# Altium schematic sheet schematic.SchDoc
size A2; SheetNumber: 1; SheetTotal: 1
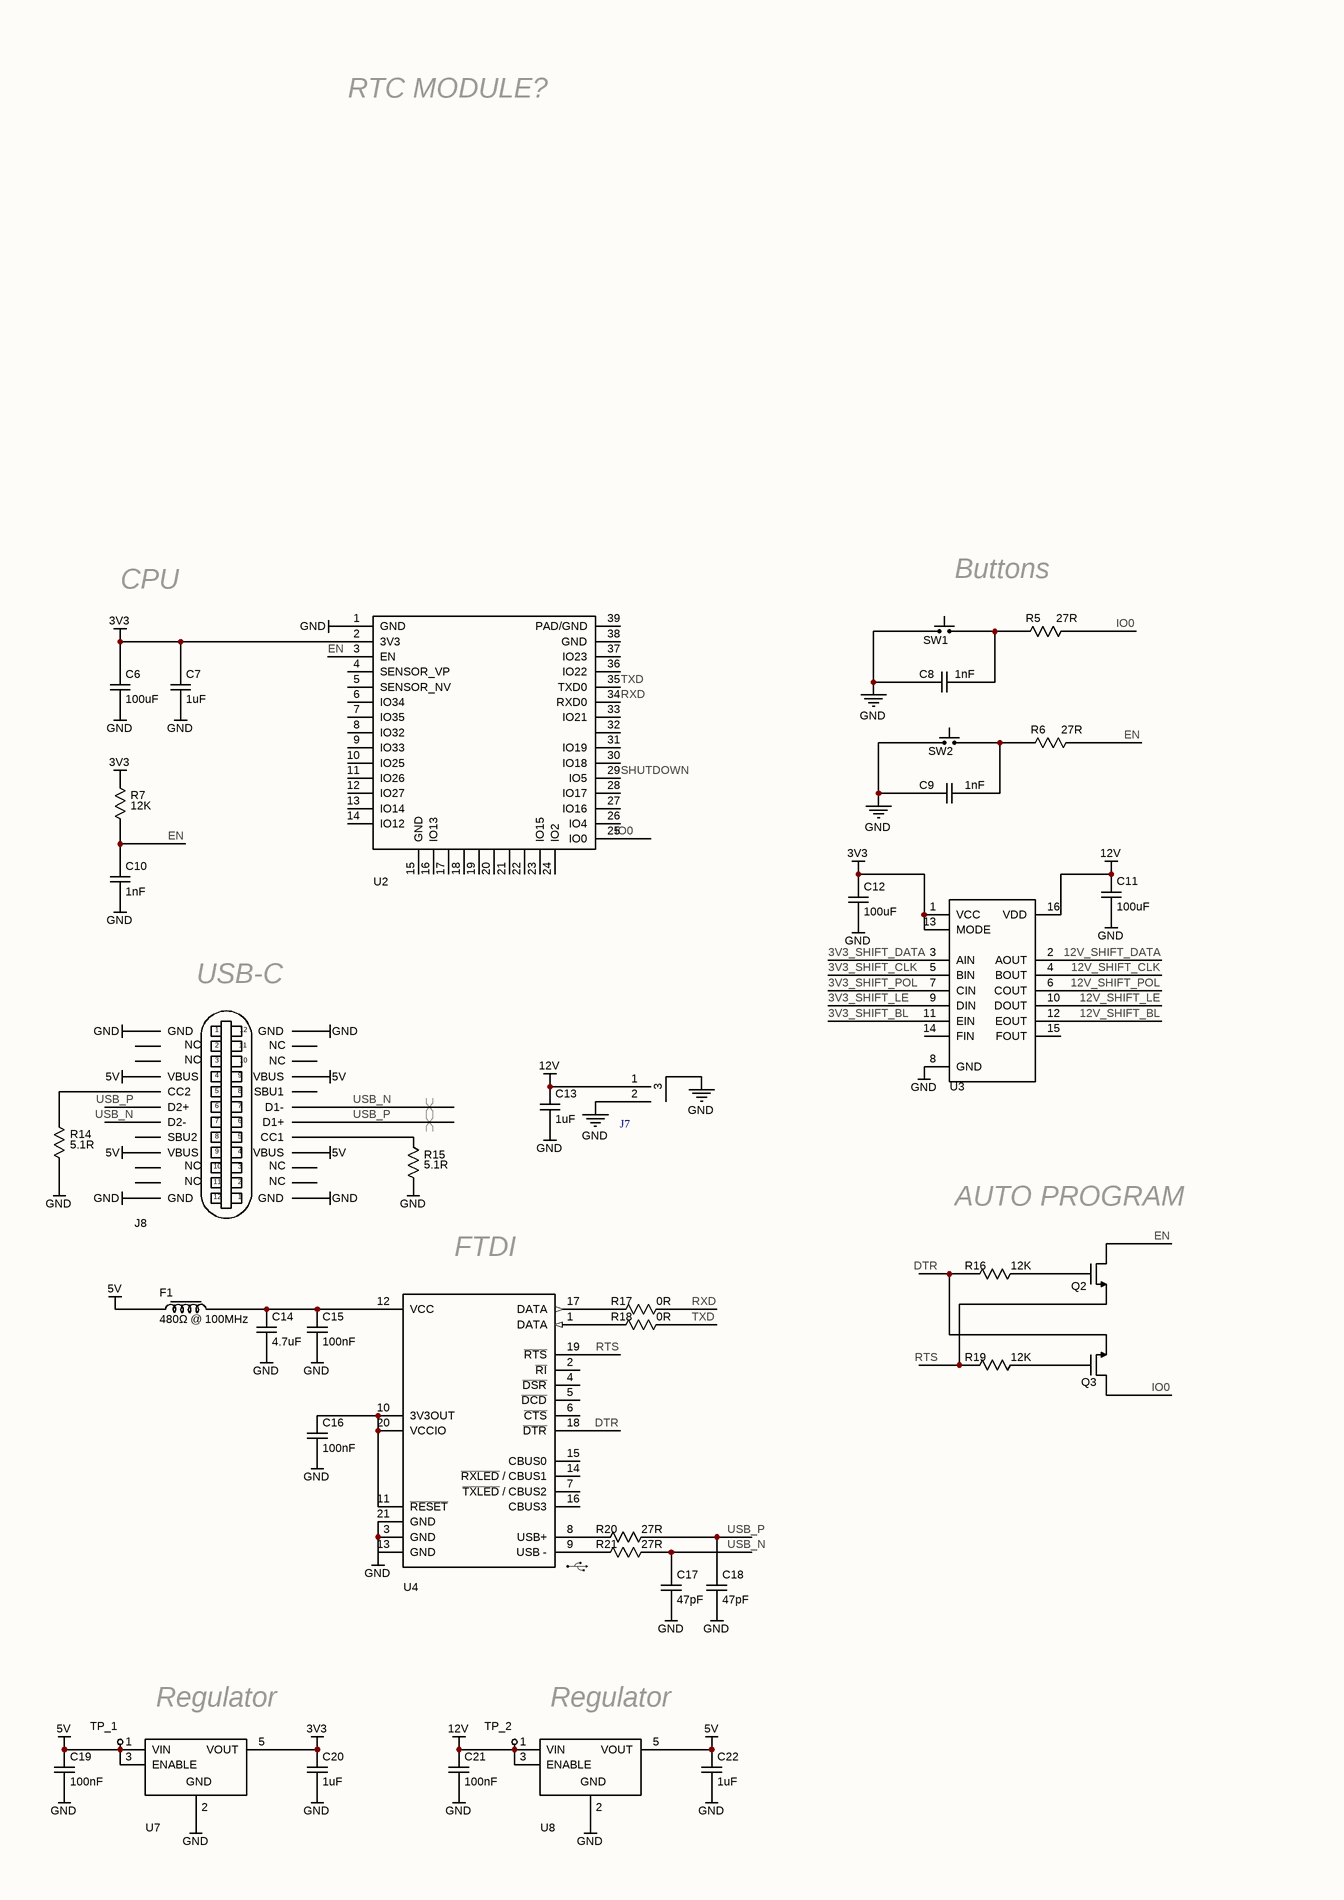
[diagram p0: schematic.SchDoc, left]
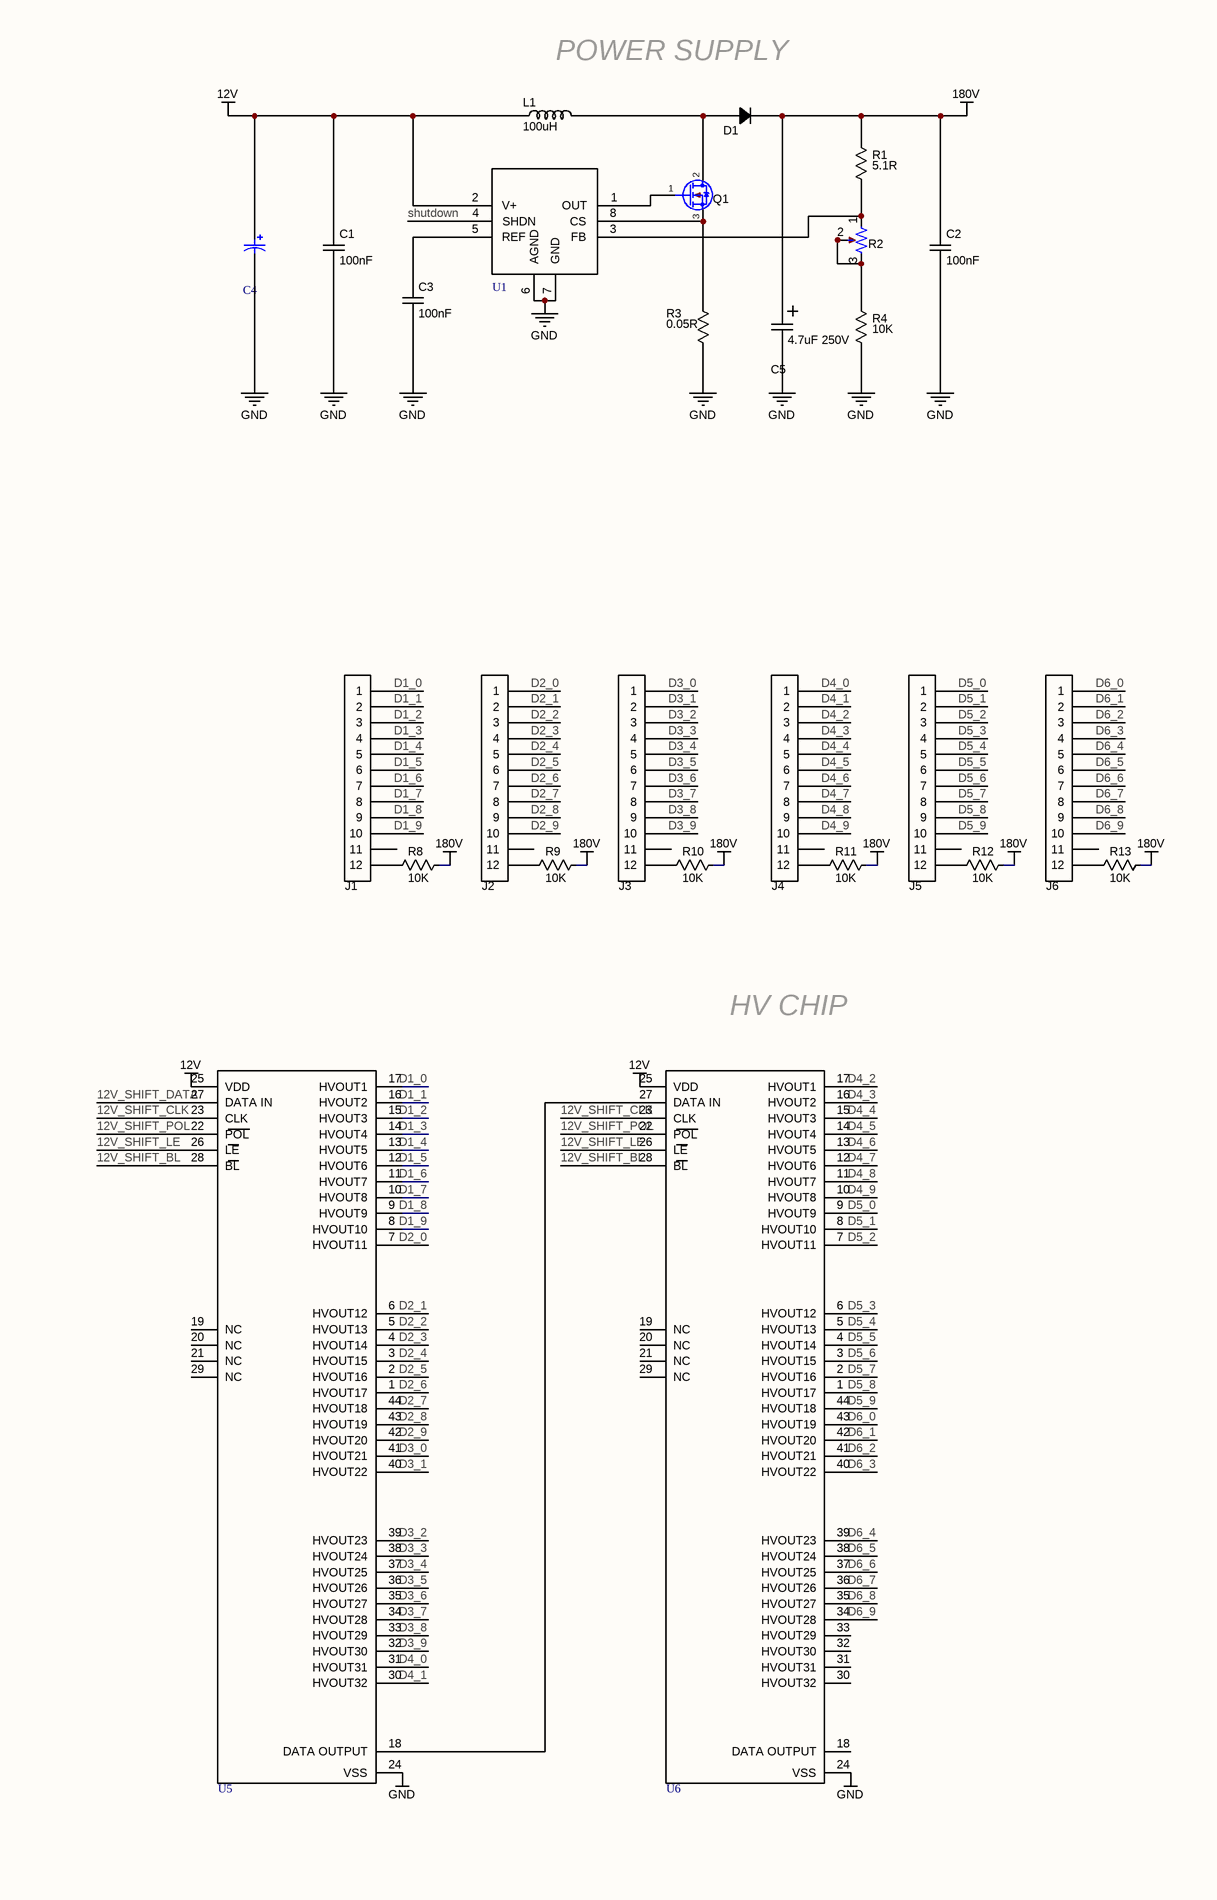
[diagram p1: schematic.SchDoc, right]

## Parts
C1  value 100nF  [capacitor 0603]  (hidden comment: passive_5)
C2  value 100nF  [capacitor 0603]  (hidden comment: passive_5)
C3  value 100nF  [capacitor 0603]  (hidden comment: passive_5)
C4  Tantal-kondensatorer  [TAJD107K020RNJ]  (value not drawn)
C5  value 4.7uF 250V  [4.7uF 250V]  (hidden comment: cappacitor)
C6  value 100uF  [capacitor 0603]  (hidden comment: passive_5)
C7  value 1uF  [capacitor 0603]  (hidden comment: passive_5)
C8  value 1nF  [capacitor 0603]  (hidden comment: passive_5)
C9  value 1nF  [capacitor 0603]  (hidden comment: passive_5)
C10  value 1nF  [capacitor 0603]  (hidden comment: passive_5)
C11  value 100uF  [capacitor 0603]  (hidden comment: passive_5)
C12  value 100uF  [capacitor 0603]  (hidden comment: passive_5)
C13  value 1uF  [capacitor 0603]  (hidden comment: passive_5)
C14  value 4.7uF  [capacitor 0603]  (hidden comment: passive_5)
C15  value 100nF  [capacitor 0603]  (hidden comment: passive_5)
C16  value 100nF  [capacitor 0603]  (hidden comment: passive_5)
C17  value 47pF  [capacitor 0603]  (hidden comment: passive_5)
C18  value 47pF  [capacitor 0603]  (hidden comment: passive_5)
C19  value 100nF  [capacitor 0603]  (hidden comment: passive_5)
C20  value 1uF  [capacitor 0603]  (hidden comment: passive_5)
C21  value 100nF  [capacitor 0603]  (hidden comment: passive_5)
C22  value 1uF  [capacitor 0603]  (hidden comment: passive_5)
D1  ES2F-E3/52T  [ES2F-E3/52T]  (value not drawn)
F1  value 480Ω @ 100MHz  [ferrit bead 0603]  (hidden comment: passive_8)
J1  Header 2mm  [9159 edge connector]  (value not drawn)
J2  Header 2mm  [9159 edge connector]  (value not drawn)
J3  Header 2mm  [9159 edge connector]  (value not drawn)
J4  Header 2mm  [9159 edge connector]  (value not drawn)
J5  Header 2mm  [9159 edge connector]  (value not drawn)
J6  Header 2mm  [9159 edge connector]  (value not drawn)
J7  dc-jack  [BarrelJack]  (value not drawn)
J8  USB 2.0  [USB4105-GF-A]  (value not drawn)
L1  value 100uH  [SRR1210-101M]  (hidden comment: SRR1210-101M)
Q1  regulator_5  [IRF740STRLPBF]  (value not drawn)
Q2  transistor_7  [S8050]  (value not drawn)
Q3  transistor_7  [S8050]  (value not drawn)
R1  value 5.1R  [resistor 0603]  (hidden comment: passive_2)
R2  potmeter 3314G-1-502E  [potmeter 3314G-1-502E]  (value not drawn)
R3  value 0.05R  [resistor 0805]  (hidden comment: passive_3)
R4  value 10K  [resistor 0603]  (hidden comment: passive_2)
R5  value 27R  [resistor 0603]  (hidden comment: passive_2)
R6  value 27R  [resistor 0603]  (hidden comment: passive_2)
R7  value 12K  [resistor 0603]  (hidden comment: passive_2)
R8  value 10K  [resistor 0603]  (hidden comment: passive_2)
R9  value 10K  [resistor 0603]  (hidden comment: passive_2)
R10  value 10K  [resistor 0603]  (hidden comment: passive_2)
R11  value 10K  [resistor 0603]  (hidden comment: passive_2)
R12  value 10K  [resistor 0603]  (hidden comment: passive_2)
R13  value 10K  [resistor 0603]  (hidden comment: passive_2)
R14  value 5.1R  [resistor 0603]  (hidden comment: passive_2)
R15  value 5.1R  [resistor 0603]  (hidden comment: passive_2)
R16  value 12K  [resistor 0603]  (hidden comment: passive_2)
R17  value 0R  [resistor 0603]  (hidden comment: passive_2)
R18  value 0R  [resistor 0603]  (hidden comment: passive_2)
R19  value 12K  [resistor 0603]  (hidden comment: passive_2)
R20  value 27R  [resistor 0603]  (hidden comment: passive_2)
R21  value 27R  [resistor 0603]  (hidden comment: passive_2)
SW1  sensor_3  [KMR621NG LFS]  (value not drawn)
SW2  sensor_3  [KMR621NG LFS]  (value not drawn)
TP_1  misc_3  [testpoint round, diameter 1.5mm]  (value not drawn)
TP_2  misc_3  [testpoint round, diameter 1.5mm]  (value not drawn)
U1  MAX1771  [SOIC-8]  (value not drawn)
U2  cpu_7  [ESP32-WROOM-32]  (value not drawn)
U3  MC14504BDTR2G  [MC14504BDTR2G]  (value not drawn)
U4  FTDI  [FT231XQ-R]  (value not drawn)
U5  HV5630PJ  [HV5630PJ]  (value not drawn)
U6  HV5630PJ  [HV5630PJ]  (value not drawn)
U7  regulator_1  [TCR2EF33,LM(CT]  (value not drawn)
U8  regulator_1  [TCR2EF33,LM(CT]  (value not drawn)

## Nets
3V3: C6.2 C7.2 C12.2 C20.2 R7.2 U2.2(3V3) U3.1(VCC) U3.13(MODE) U7.5(VOUT)
5V: C19.2 C22.2 F1.1 J8.A4_B9(VBUS) J8.B4_A9(VBUS) TP_1.1 U7.1(VIN) U7.3(ENABLE) U8.5(VOUT)
12V: C1.2 C4.1 C11.2 C13.2 C21.2 J7.1(Pin_1) L1.1 TP_2.1 U1.2(V+) U3.16(VDD) U5.25(VDD) U6.25(VDD) U8.1(VIN) U8.3(ENABLE)
180V: C2.2 C5.1 D1.2 R1.2 R8.1 R9.1 R10.1 R11.1 R12.1 R13.1
GND: C1.1 C2.1 C3.1 C4.2 C5.2 C6.1 C7.1 C8.2 C9.2 C10.1 C11.1 C12.1 C13.1 C14.1 C15.1 C16.1 C17.1 C18.1 C19.1 C20.1 C21.1 C22.1 J7.2(Pin_2) J7.3(Pin_2) J8.A1_B12(GND) J8.B1_A12(GND) R3.1 R4.1 R14.1 R15.1 SW1.1 SW2.1 U1.6(AGND) U1.7(GND) U2.1(GND) U3.8(GND) U4.3(GND) U4.13(GND) U4.21(GND) U5.24(VSS) U6.24(VSS) U7.2 U8.2
3V3_SHIFT_BL: U3.11(EIN)
3V3_SHIFT_CLK: U3.5(BIN)
3V3_SHIFT_DATA: U3.3(AIN)
3V3_SHIFT_LE: U3.9(DIN)
3V3_SHIFT_POL: U3.7(CIN)
12V_SHIFT_BL: U3.12(EOUT) U5.28(BL) U6.28(BL)
12V_SHIFT_CLK: U3.4(BOUT) U5.23(CLK) U6.23(CLK)
12V_SHIFT_DATA: U3.2(AOUT) U5.27(DATA_IN)
12V_SHIFT_LE: U3.10(DOUT) U5.26(LE) U6.26(LE)
12V_SHIFT_POL: U3.6(COUT) U5.22(POL) U6.22(POL)
D1_0: J1.1 U5.17(HVOUT1)
D1_1: J1.2 U5.16(HVOUT2)
D1_2: J1.3 U5.15(HVOUT3)
D1_3: J1.4 U5.14(HVOUT4)
D1_4: J1.5 U5.13(HVOUT5)
D1_5: J1.6 U5.12(HVOUT6)
D1_6: J1.7 U5.11(HVOUT7)
D1_7: J1.8 U5.10(HVOUT8)
D1_8: J1.9 U5.9(HVOUT9)
D1_9: J1.10 U5.8(HVOUT10)
D2_0: J2.1 U5.7(HVOUT11)
D2_1: J2.2 U5.6(HVOUT12)
D2_2: J2.3 U5.5(HVOUT13)
D2_3: J2.4 U5.4(HVOUT14)
D2_4: J2.5 U5.3(HVOUT15)
D2_5: J2.6 U5.2(HVOUT16)
D2_6: J2.7 U5.1(HVOUT17)
D2_7: J2.8 U5.44(HVOUT18)
D2_8: J2.9 U5.43(HVOUT19)
D2_9: J2.10 U5.42(HVOUT20)
D3_0: J3.1 U5.41(HVOUT21)
D3_1: J3.2 U5.40(HVOUT22)
D3_2: J3.3 U5.39(HVOUT23)
D3_3: J3.4 U5.38(HVOUT24)
D3_4: J3.5 U5.37(HVOUT25)
D3_5: J3.6 U5.36(HVOUT26)
D3_6: J3.7 U5.35(HVOUT27)
D3_7: J3.8 U5.34(HVOUT28)
D3_8: J3.9 U5.33(HVOUT29)
D3_9: J3.10 U5.32(HVOUT30)
D4_0: J4.1 U5.31(HVOUT31)
D4_1: J4.2 U5.30(HVOUT32)
D4_2: J4.3 U6.17(HVOUT1)
D4_3: J4.4 U6.16(HVOUT2)
D4_4: J4.5 U6.15(HVOUT3)
D4_5: J4.6 U6.14(HVOUT4)
D4_6: J4.7 U6.13(HVOUT5)
D4_7: J4.8 U6.12(HVOUT6)
D4_8: J4.9 U6.11(HVOUT7)
D4_9: J4.10 U6.10(HVOUT8)
D5_0: J5.1 U6.9(HVOUT9)
D5_1: J5.2 U6.8(HVOUT10)
D5_2: J5.3 U6.7(HVOUT11)
D5_3: J5.4 U6.6(HVOUT12)
D5_4: J5.5 U6.5(HVOUT13)
D5_5: J5.6 U6.4(HVOUT14)
D5_6: J5.7 U6.3(HVOUT15)
D5_7: J5.8 U6.2(HVOUT16)
D5_8: J5.9 U6.1(HVOUT17)
D5_9: J5.10 U6.44(HVOUT18)
D6_0: J6.1 U6.43(HVOUT19)
D6_1: J6.2 U6.42(HVOUT20)
D6_2: J6.3 U6.41(HVOUT21)
D6_3: J6.4 U6.40(HVOUT22)
D6_4: J6.5 U6.39(HVOUT23)
D6_5: J6.6 U6.38(HVOUT24)
D6_6: J6.7 U6.37(HVOUT25)
D6_7: J6.8 U6.36(HVOUT26)
D6_8: J6.9 U6.35(HVOUT27)
D6_9: J6.10 U6.34(HVOUT28)
DTR: Q3.2 R16.2 U4.18(~{DTR})
EN: C10.2 Q2.3 R6.1 R7.1 U2.3(EN)
IO0: Q3.3 R5.1 U2.25(IO0)
RTS: Q2.2 R19.2 U4.19(~{RTS})
RXD: R17.1 U2.34(RXD0)
shutdown: U1.4(SHDN) U2.29(IO5)
TXD: R18.1 U2.35(TXD0)
USB_N: C17.2 J8.A7(D1-) J8.B7(D2-) R21.1
USB_P: C18.2 J8.A6(D1+) J8.B6(D2+) R20.1
NetC3_2: C3.2 U1.5(REF)
NetC8_1: C8.1 R5.2 SW1.2
NetC9_1: C9.1 R6.2 SW2.2
NetC14_2: C14.2 C15.2 F1.2 U4.12(VCC)
NetC16_2: C16.2 U4.10(3V3OUT) U4.11(~{RESET}) U4.20(VCCIO)
NetD1_1: D1.1 L1.2 Q1.2(D)
NetJ1_12: J1.12 R8.2
NetJ2_12: J2.12 R9.2
NetJ3_12: J3.12 R10.2
NetJ4_12: J4.12 R11.2
NetJ5_12: J5.12 R12.2
NetJ6_12: J6.12 R13.2
NetJ8_A5: J8.A5(CC1) R15.2
NetJ8_B5: J8.B5(CC2) R14.2
NetQ1_1: Q1.1(G) U1.1(OUT)
NetQ1_3: Q1.3(S) R3.2 U1.8(CS)
NetQ2_1: Q2.1 R16.1
NetQ3_1: Q3.1 R19.1
NetR1_1: R1.1 R2.1 U1.3(FB)
NetR2_2: R2.2 R2.3 R4.2
NetR17_2: R17.2 U4.17(DATA)
NetR18_2: R18.2 U4.1(DATA)
NetR20_2: R20.2 U4.8(USB+)
NetR21_2: R21.2 U4.9(USB_-)
NetU5_18: U5.18(DATA_OUTPUT) U6.27(DATA_IN)

Not connected (* = marked no-connect by the designer): J1 11; J2 11; J3 11; J4 11; J5 11; J6 11; J8 A8(SBU1) B8(SBU2); U2 4(SENSOR_VP) 5(SENSOR_NV) 6(IO34) 7(IO35) 8(IO32) 9(IO33) 10(IO25) 11(IO26) 12(IO27) 13(IO14) 14(IO12) 15(GND) 16(IO13) 17 18 19 20 21 22 23(IO15) 24(IO2) 26(IO4) 27(IO16) 28(IO17) 30(IO18) 31(IO19) 32 33(IO21) 36(IO22) 37(IO23) 38(GND) 39(PAD/GND); U3 14(FIN) 15(FOUT); U4 2(~{RI}) 4(~{DSR}) 5(~{DCD}) 6(~{CTS}) 7(~{TXLED}_/_CBUS2) 14(~{RXLED}_/_CBUS1) 15(CBUS0) 16(CBUS3); U5 19(NC) 20(NC) 21(NC) 29(NC); U6 18(DATA_OUTPUT) 19(NC) 20(NC) 21(NC) 29(NC) 30(HVOUT32) 31(HVOUT31) 32(HVOUT30) 33(HVOUT29)

## Layout directives
differential pair: USB_N, USB_P

## Notes on the sheet
- POWER SUPPLY
- RTC MODULE?
- Buttons
- CPU
- (near J8) USB-C
- HV CHIP
- AUTO PROGRAM
- FTDI
- Regulator
- (in symbol connector_35) 1; 12; NC; 2; 11; 3; 10; 4; 9; 5; 8; 6; 7
- (in symbol regulator_1) GND

## Library data of the parts
C1-C3 C6-C22 = passive_5: Capacitor 0603
C4 = Tantal-kondensatorer: Value: 100uF
C5 = cappacitor: 4.7uF 250Vc; ComponentLink1Description: New link; ComponentLink1URL: https://www.digikey.ca/en/products/detail/kemet/A759KS475M2EAAE496/6196534
D1 = ES2F-E3/52T: diode; ComponentLink1Description: New link; ComponentLink1URL: https://www.digikey.no/en/products/detail/vishay-general-semiconductor-diodes-division/ES2F-E3-52T/1091445?s=N4IgTCBcDaIAQB0AuBRAymAYgWhQZgHoBWMAFRAF0BfIA
F1 = passive_8: Ferrite bead 0603
J1-J6 = edge connector: Header male 1x6, pitch 2mm; ComponentLink1Description: link; ComponentLink1URL: https://www.digikey.no/en/products/detail/kyocera-avx/009159012651906/15995075
J8 = connector_35: USB-C (2.0); Manufacturer 1: GCT; Supplier 1: Digi-Key; Supplier Part Number 1: 2073-USB4105-GF-ACT-ND; Manufacturer Part Number 1: USB4105-GF-A; Link: https://www.digikey.no/product-detail/no/gct/USB4105-GF-A/2073-USB4105-GF-ACT-ND/11198510
Q1 = regulator_5: IRF740STRLPBF; ComponentLink1Description: New link; ComponentLink1URL: https://www.digikey.ca/en/products/detail/vishay-siliconix/IRF740STRLPBF/856617?s=N4IgTCBcDaIAQB0AuBJASgMQOwBYAMAygCpoAyACgEIYgC6AvkA
Q2 Q3 = transistor_7: S8050 NPN TRANSISTOR
R1 R4-R21 = passive_2: Resistor 0603
R3 = passive_3: Resistor 0805; Link: https://www.digikey.no/en/products/detail/thin-film-technology-corp/D1WEL0805CR050F-T5/16735407
SW1 SW2 = sensor_3: Tactile switch SMD, tiny; Manufacturer 1: C&K; Supplier 1: Digi-Key; Supplier Part Number 1: CKN10684CT-ND; Manufacturer Part Number 1: KMR621NG LFS; Link: https://www.digikey.no/product-detail/en/c-k/KMR621NG-LFS/CKN10684CT-ND/6035356
TP_1 TP_2 = misc_3: Test-point round, diameter 1.5mm
U2 = cpu_7: ESP32-WROOM-32; ComponentLink1Description: New link; ComponentLink1URL: https://www.digikey.no/no/products/detail/espressif-systems/ESP32-WROOM-32E-H4/12696413
U3 = MC14504BDTR2G: Level shifter, 3.3V to 12V; Link: https://www.digikey.no/en/products/detail/onsemi/MC14504BDTR2G/1478864
U4 = ic_1: USB to UART converter, FTDI, single, 20 pins, QFN; Manufacturer 1: FTDI, Future Technology Devices International Ltd; Supplier 1: Digi-Key; Supplier Part Number 1: 768-1128-1-ND; Manufacturer Part Number 1: FT231XQ-R
U7 U8 = regulator_1: LDO fixed, 3.3V output, 0.2V dropout, 200mA; Manufacturer 1: Toshiba Semiconductor and Storage; Supplier 1: Digi-Key; Supplier Part Number 1: TCR2EF33LM(CTCT-ND; Manufacturer Part Number 1: TCR2EF33,LM(CT; Output voltage: 3.3V; Dropout: 0.2V; Current: 200mA; Link: https://www.digikey.no/product-detail/en/toshiba-semiconductor-and-storage/TCR2EF33-LM-CT/TCR2EF33LM-CTCT-ND/4503328
J7 = dc-jack: ComponentLink1Description: New link; ComponentLink1URL: https://www.digikey.no/en/products/detail/cui-devices/PJ-002A/96962
L1 = SRR1210-101M: Link: https://www.digikey.ca/en/products/detail/bourns-inc/SRR1210-101M/2352898
R2 = potmeter 3314G-1-502E: ComponentLink1Description: Value; ComponentLink1URL: 5kR; ComponentLink2Description: link; ComponentLink2URL: https://www.digikey.no/no/products/detail/bourns-inc/3314G-1-502E/86462; ComponentLink3Description: New link 1; ComponentLink3URL: *
U1 = MAX1771: ComponentLink1Description: New link; ComponentLink1URL: https://no.mouser.com/ProductDetail/Analog-Devices-Maxim-Integrated/MAX1771CSA+?qs=1THa7WoU59HAVajYWe%2BFOg%3D%3D&utm_source=OEMSecrets&utm_medium=aggregator&utm_campaign=MAX1771CSA+&utm_term=MAX1771CSA&utm_content=Analog+Devices+Inc.